# EAGLE schematic Shibobi_PowerMeasure (EAGLE 8.7.0)
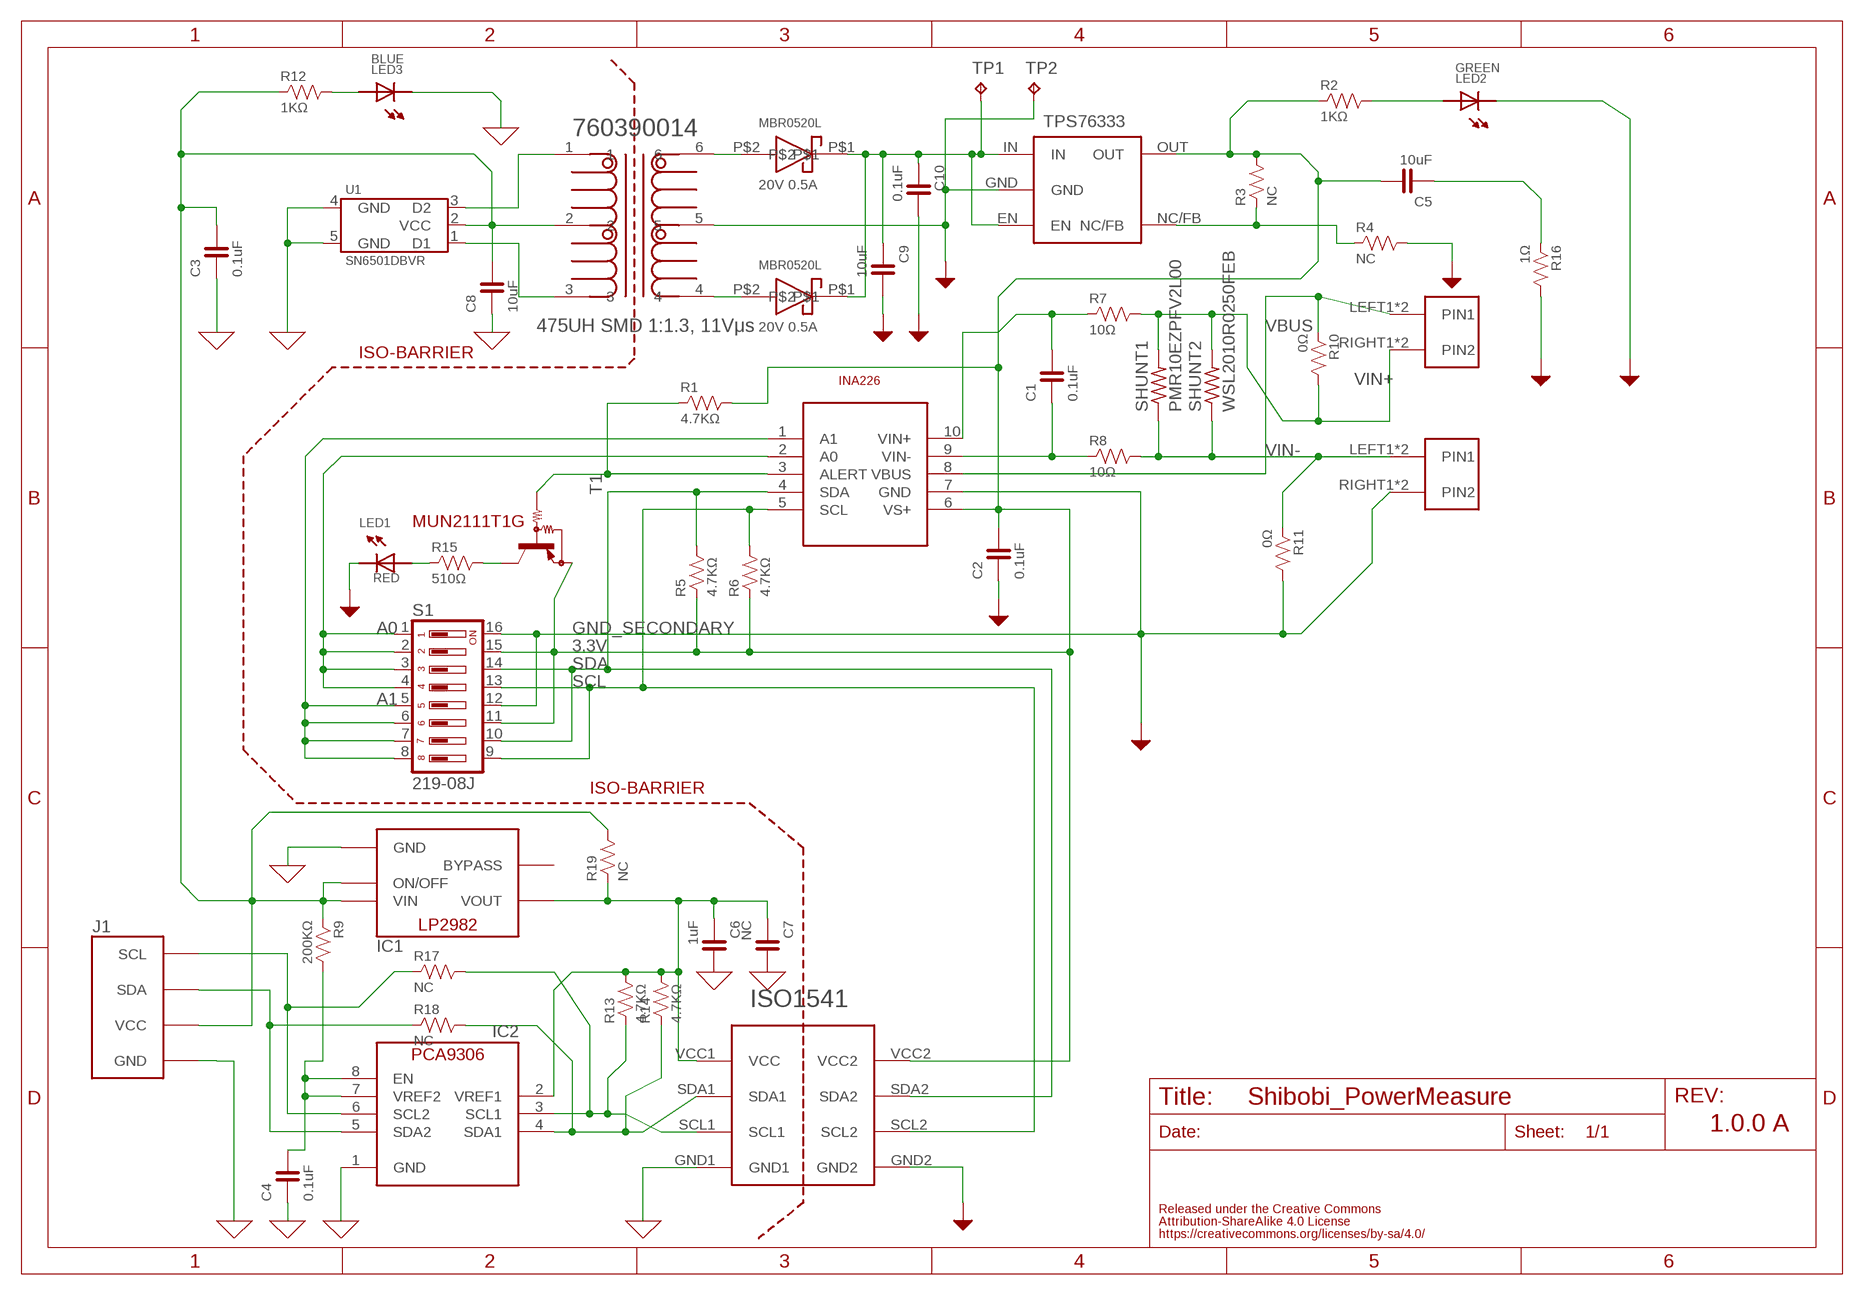
[diagram p0: schematic, sheet 1]

## Parts
C1  0.1uF  CAPACITOR-0603  [0603]
C2  0.1uF  CAPACITOR-0603  [0603]
C3  0.1uF  CAPACITOR-0603  [0603]
C4  0.1uF  CAPACITOR-0603  [0603]
C5  10uF  CAPACITOR-0603  [0603]
C6  1uF  CAPACITOR-0603  [0603]
C7  NC  CAPACITOR-0603  [0603]
C8  10uF  CAPACITOR-0603  [0603]
C9  10uF  CAPACITOR-0603  [0603]
C10  0.1uF  CAPACITOR-0603  [0603]
D1  MBR0520L  [MBR0502L]
D2  MBR0520L  [MBR0502L]
IC1  3.3V  LP2982  [SOT-23-5]
IC2  PCA9306GM  [XQFN8]
ISO  ISO1541  [ISO1541]
J1  FABO_BRICK_I2C-S04B-PASK-2  [FABO_BRICK_I2C_S04B-PASK-2]
LED1  RED  LED-0603  [0603]
LED2  GREEN  LED-0603  [0603]
LED3  BLUE  LED-0603  [0603]
R1  4.7KΩ  RESISTOR-0603  [0603]
R2  1KΩ  RESISTOR-0603  [0603]
R3  NC  RESISTOR-0603  [0603]
R4  NC  RESISTOR-0603  [0603]
R5  4.7KΩ  RESISTOR-0603  [0603]
R6  4.7KΩ  RESISTOR-0603  [0603]
R7  10Ω  RESISTOR-0603  [0603]
R8  10Ω  RESISTOR-0603  [0603]
R9  200KΩ  RESISTOR-0603  [0603]
R10  0Ω  RESISTOR-0603  [0603]
R11  0Ω  RESISTOR-0603  [0603]
R12  1KΩ  RESISTOR-0603  [0603]
R13  4.7KΩ  RESISTOR-0603  [0603]
R14  4.7KΩ  RESISTOR-0603  [0603]
R15  510Ω  RESISTOR-0603  [0603]
R16  1Ω  RESISTOR-0603  [0603]
R17  NC  RESISTOR-0603  [0603]
R18  NC  RESISTOR-0603  [0603]
R19  NC  RESISTOR-0603  [0603]
S1  219-08J  [CTS-219-08J]
SHUNT1  PMR10EZPFV2L00  [PMR10EZPFV2L00]
SHUNT2  WSL2010R0250FEB  [WSL2010R0250FEB]
T1  MUN2111T1-PNP_DRIVER-SC59-BEC  [SC59-BEC]
T2  760390014  [760390014]
TP1  TPPAD1-17  [P1-17]
TP2  TPPAD1-17  [P1-17]
U1  SN6501DBVR  [SOT-23-5]
U2  TI-INA226  [TI-INA226]
U$2  ML-1400-S1  [ML-1400-S1]
U$3  ML-1400-S1  [ML-1400-S1]
U$8  TPS76333  [TPS76333]

## Nets
3.3V: C2.2 C5.2 ISO.VCC2 R1.2 R2.1 R3.2 R5.1 R6.1 S1.11 S1.15 T1.E U2.6(VS+) U$8.OUT
A0: S1.1 S1.2 S1.3 S1.4 U2.2(A0)
A1: S1.5 S1.6 S1.7 S1.8 U2.1(A1)
GND: C3.1 C4.1 C6.2 C7.2 C8.1 IC1.2(GND) IC2.1(GND) ISO.GND1 J1.GND LED3.CATHODE U1.4(GND) U1.5(GND)
GND_SECONDARY: C2.1 C9.2 C10.2 ISO.GND2 LED1.CATHODE LED2.CATHODE R4.2 R11.2 R16.2 S1.12 S1.16 T2.5 TP2.TP U2.7(GND) U$3.RIGHT1(PIN2) U$3.RIGHT2(PIN2) U$8.GND ; supply symbol labelled GND_SEC
N$1: C1.2 R7.1 U2.10(VIN+)
N$2: C1.1 R8.1 U2.9(VIN-)
N$3: T2.1 U1.3(D2)
N$4: T2.3 U1.1(D1)
N$5: R1.1 T1.B U2.3(ALERT)
N$7: LED1.ANODE R15.1
N$8: LED2.ANODE R2.2
N$9: R15.2 T1.C
N$10: LED3.ANODE R12.2
N$11: IC2.4(SDA1) ISO.SDA1 R14.1 R18.2
N$12: IC2.6(SCL2) J1.SCL R17.1
N$13: C6.1 C7.1 IC1.5(VOUT) IC2.2(VREF1) ISO.VCC1(VCC) R13.2 R14.2 R19.1
N$14: D1.P$2 T2.6
N$15: D2.P$2 T2.4
N$16: C9.1 C10.1 D1.P$1 D2.P$1 TP1.TP U$8.EN U$8.IN
N$18: C4.2 IC2.7(VREF2) IC2.8(EN) R9.2
N$19: C3.2 C8.2 IC1.1(VIN) IC1.3(ON/OFF) J1.VCC R9.1 R12.1 R19.2 T2.2 U1.2(VCC)
N$20: R3.1 R4.1 U$8.NC/FB
N$21: C5.1 R16.1
N$22: IC2.5(SDA2) J1.SDA R18.1
N$23: IC2.3(SCL1) ISO.SCL1 R13.1 R17.2
SCL: ISO.SCL2 R6.2 S1.9 S1.13 U2.5(SCL)
SDA: ISO.SDA2 R5.2 S1.10 S1.14 U2.4(SDA)
VBUS: R10.1 U2.8(VBUS) U$2.LEFT1(PIN1) U$2.LEFT2(PIN1)
VIN+: R7.2 R10.2 SHUNT1.P$2 SHUNT2.P$2 U$2.RIGHT1(PIN2) U$2.RIGHT2(PIN2)
VIN-: R8.2 R11.1 SHUNT1.P$1 SHUNT2.P$1 U$3.LEFT1(PIN1) U$3.LEFT2(PIN1)
Unconnected: IC1.4(BYPASS)

## Notes on the sheet
- ISO-BARRIER
- MUN2111T1G
- ISO-BARRIER
- 1.0.0 A

## Library data of the parts
C1-C10 = FaBo-Capacitor:CAPACITOR: CAPACITOR
D1 D2 = FaBo:MBR0520L
IC1 = FaBo-Supply:LP2982
IC2 = FaBo-LevelTranslator:PCA9306
ISO = FaBo:ISO1541
J1 = FaBo-Template:FABO_BRICK_I2C: FaBo Brick I2C
LED1-LED3 = FaBo-LED:LED
R1-R19 = FaBo-Resistors:RESISTOR: RESISTOR
S1 = switch-dil:219-08*: Surface Mount DIP Switch Series 219 SMT CTS Electronic Components Sourc: www.ctscorp.com; OC_FARNELL: unknown; OC_NEWARK: unknown
SHUNT1 = FaBo:PMR10EZPFV2L00
SHUNT2 = FaBo:WSL2010R0250FEB
T1 = transistor:*-PNP_DRIVER-: PNP Bias Resistor Transistor
T2 = FaBo:760390014
TP1 TP2 = testpad:TP: Test pad
U1 = TI:SN6501
U2 = FaBo-Sensor:TI-INA226
U$2 = FaBo-Terminal:ML-1400-S1; SPICEPREFIX: B
U$3 = FaBo-Terminal:ML-1400-S1
U$8 = FaBo:TPS76333